# EAGLE schematic main (EAGLE 8.0.2)
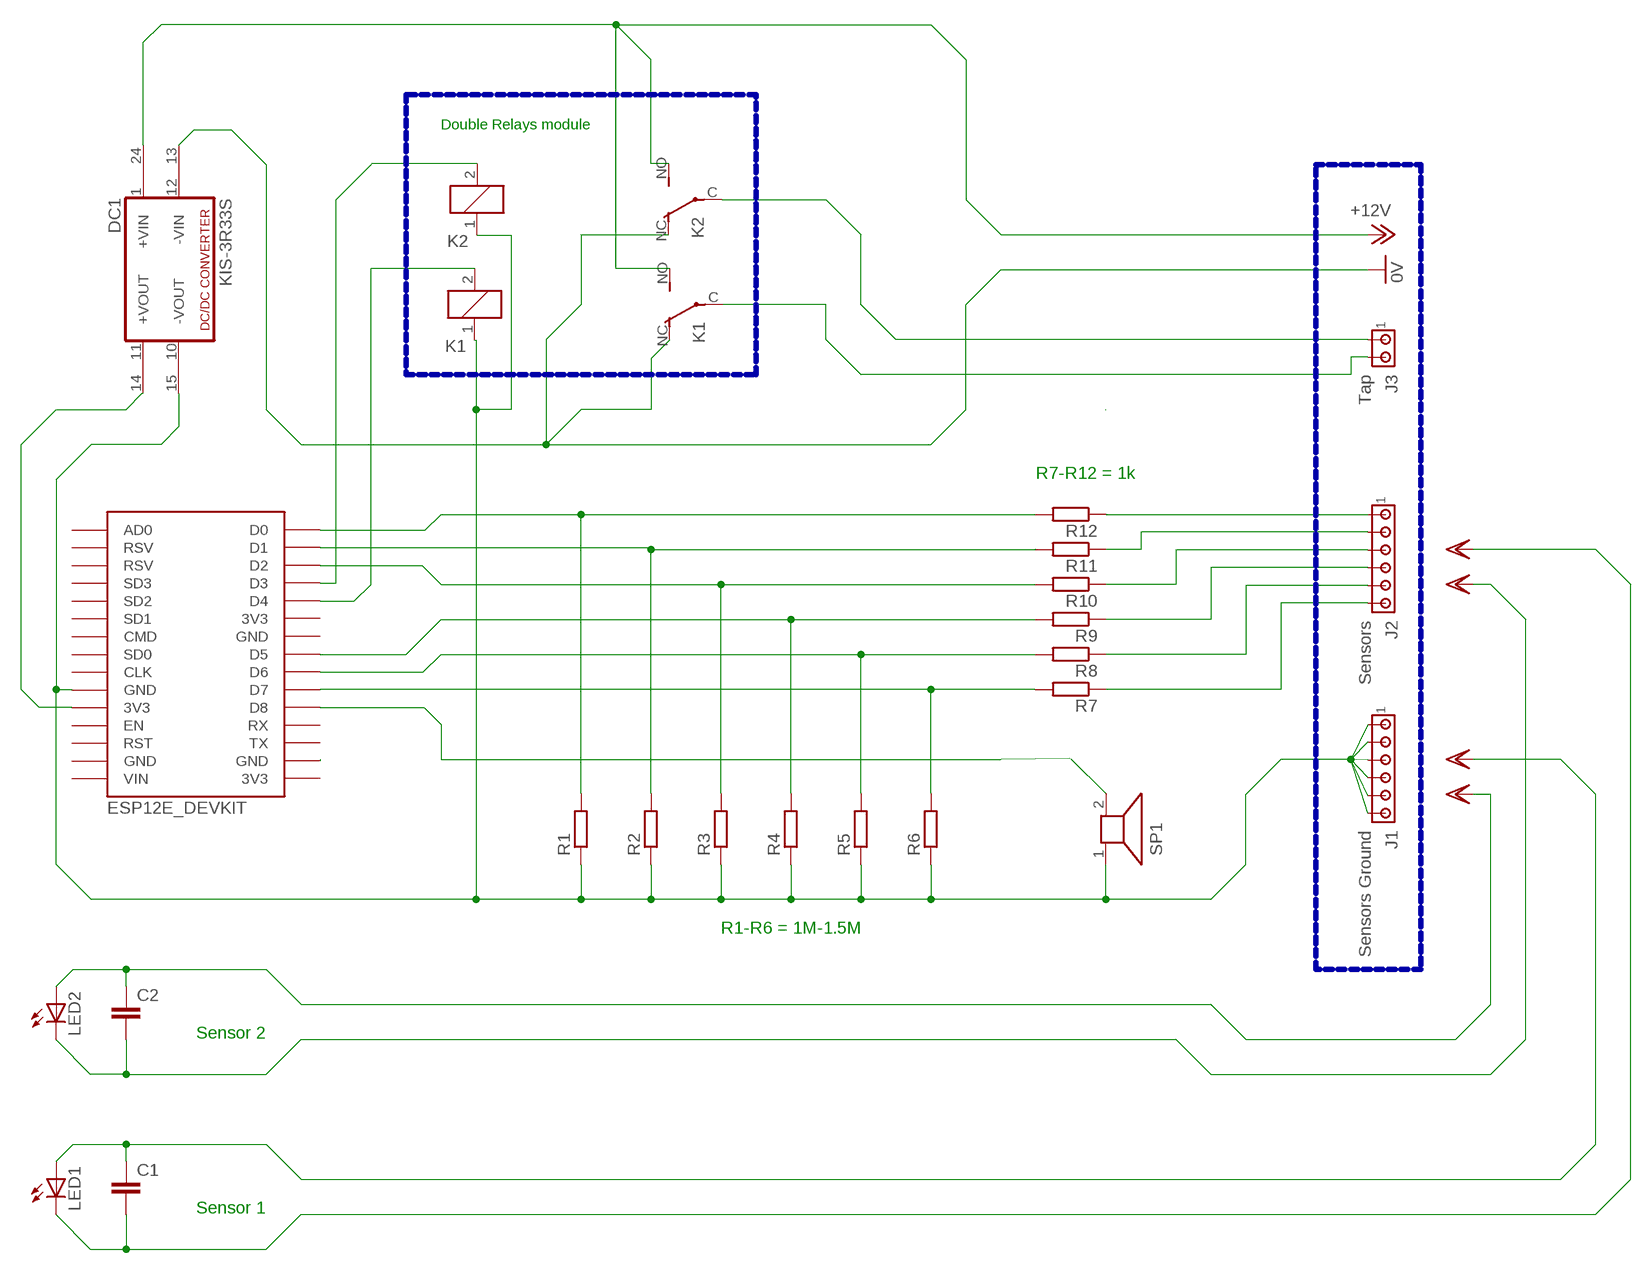
[diagram p0: schematic, sheet 1]

## Parts
C1  C2,5-3  [C2.5-3]
C2  C2,5-3  [C2.5-3]
DC1  KIS-3R33S  DC213R  [CMK]
J1  Sensors Ground  MTA06-156  [1X6MTA]
J2  Sensors  MTA06-156  [1X6MTA]
J3  Tap  MTA02-156  [1X2MTA]
K1  CT112  [CT-SLIM]
K2  CT112  [CT-SLIM]
LED1  TLLG4400  [LED3MM]
LED2  TLLG4400  [LED3MM]
R1  R-EU_0204/7  [0204/7]
R2  R-EU_0204/7  [0204/7]
R3  R-EU_0204/7  [0204/7]
R4  R-EU_0204/7  [0204/7]
R5  R-EU_0204/7  [0204/7]
R6  R-EU_0204/7  [0204/7]
R7  R-EU_0204/7  [0204/7]
R8  R-EU_0204/7  [0204/7]
R9  R-EU_0204/7  [0204/7]
R10  R-EU_0204/7  [0204/7]
R11  R-EU_0204/7  [0204/7]
R12  R-EU_0204/7  [0204/7]
SP1  AL30P  [AL30P]
U$1  ESP12E_DEVKIT  [ESP12E_DEVKIT]

## Nets
0V: DC1.13(-VIN1) K1.NC(2:O) K2.NC(2:O)
+12V: DC1.24(+VIN1) K1.NO(2:S) K2.NO(2:S)
N$1: J2.6 R7.1
N$2: R1.2 R12.2 U$1.D0
N$3: R2.2 R11.2 U$1.D1
N$4: R3.2 R10.2 U$1.D2
N$5: R4.2 R9.2 U$1.D5
N$6: R5.2 R8.2 U$1.D6
N$7: R6.2 R7.2 U$1.D7
N$8: K2.2 U$1.D3
N$9: J2.1 R12.1
N$10: U$1.D8
N$11: U$1.GND@3(GND)
N$12: J3.2 K1.C(2:P)
N$13: J3.1 K2.C(2:P)
N$14: J2.2 R11.1
N$15: J2.3 R10.1
N$16: J2.5 R8.1
N$17: J2.4 R9.1
N$18: DC1.15(-VOUT1) J1.1 J1.2 J1.3 J1.4 J1.5 J1.6 K1.1 K2.1 R1.1 R2.1 R3.1 R4.1 R5.1 R6.1 SP1.1 U$1.GND@0(GND)
N$20: K1.2 U$1.D4
N$21: SP1.2
N$22: DC1.14(+VOUT1) U$1.3V3@0(3V3)
VDD: C1.2 C2.2 LED1.K(C) LED2.K(C)
VSS: C1.1 C2.1 LED1.A LED2.A
Unconnected: DC1.1(+VIN) DC1.10(-VOUT) DC1.11(+VOUT) DC1.12(-VIN) U$1.3V3@1(3V3) U$1.3V3@2(3V3) U$1.AD0 U$1.CLK U$1.CMD U$1.EN U$1.GND@1(GND) U$1.GND@2(GND) U$1.RST U$1.RSV@0(RSV) U$1.RSV@1(RSV) U$1.RX U$1.SD0 U$1.SD1 U$1.SD2 U$1.SD3 U$1.TX U$1.VIN

## Buses
B$1
B$2

## Notes on the sheet
- Double Relays module
- R7-R12 = 1k
- R1-R6 = 1M-1.5M
- Sensor 2
- Sensor 1

## Library data of the parts
C1 C2 = capacitor-wima:C: CAPACITOR naming: grid - package width
DC1 = dc-dc-converter:DC213R: DC-DC CONVERTER; OC_FARNELL: unknown; OC_NEWARK: unknown
J1 J2 = con-amp:MTA06-156: AMP connector
J3 = con-amp:MTA02-156: AMP connector
K1 K2 = relay:CT112: ULTRA SMALL AUTOMOTIVE RELAY NAiS Slim 1c type en_ds_61205_0000.pdf; OC_FARNELL: unknown; OC_NEWARK: unknown
LED1 LED2 = led:TLLG4400: Low Current (2mA) LED 3 mm Tinted Diffused Package color GREEN Source: Data sheet <http://www.farnell.com/datasheets/391098.pdf>; MF: VISHAY SEMICONDUCTOR; OC_FARNELL: 1612435
R1-R12 = rcl:R-EU_: RESISTOR, European symbol
SP1 = buzzer:AL30P: SPEAKER Source: Buerklin; OC_FARNELL: unknown; OC_NEWARK: unknown
U$1 = ESP12E_DEVKIT:ESP12E_DEVKIT: ESP12E DEVKIT BOARD